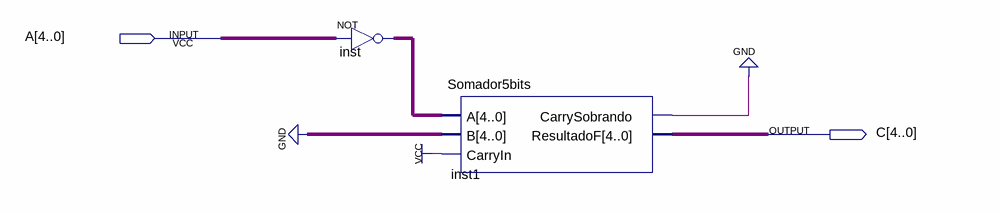
[diagram p0: schematic sheet]
// Quartus schematic cmpA2_5bits.bdf as structural Verilog: 2 symbols, 2 pins
module cmpA2_5bits (
  input  [4:0] A,
  output [4:0] C
);

  wire inst1_carrysobrando;
  wire [4:0] inst_out;

  assign inst_out = ~A;  // NOT inst, 5 bits wide
  Somador5bits inst1 (.A(inst_out), .B({5{1'b0}}), .CarryIn(1'b1), .CarrySobrando(inst1_carrysobrando), .ResultadoF(C));
  // also tied to GND on the sheet: inst1_carrysobrando
endmodule
